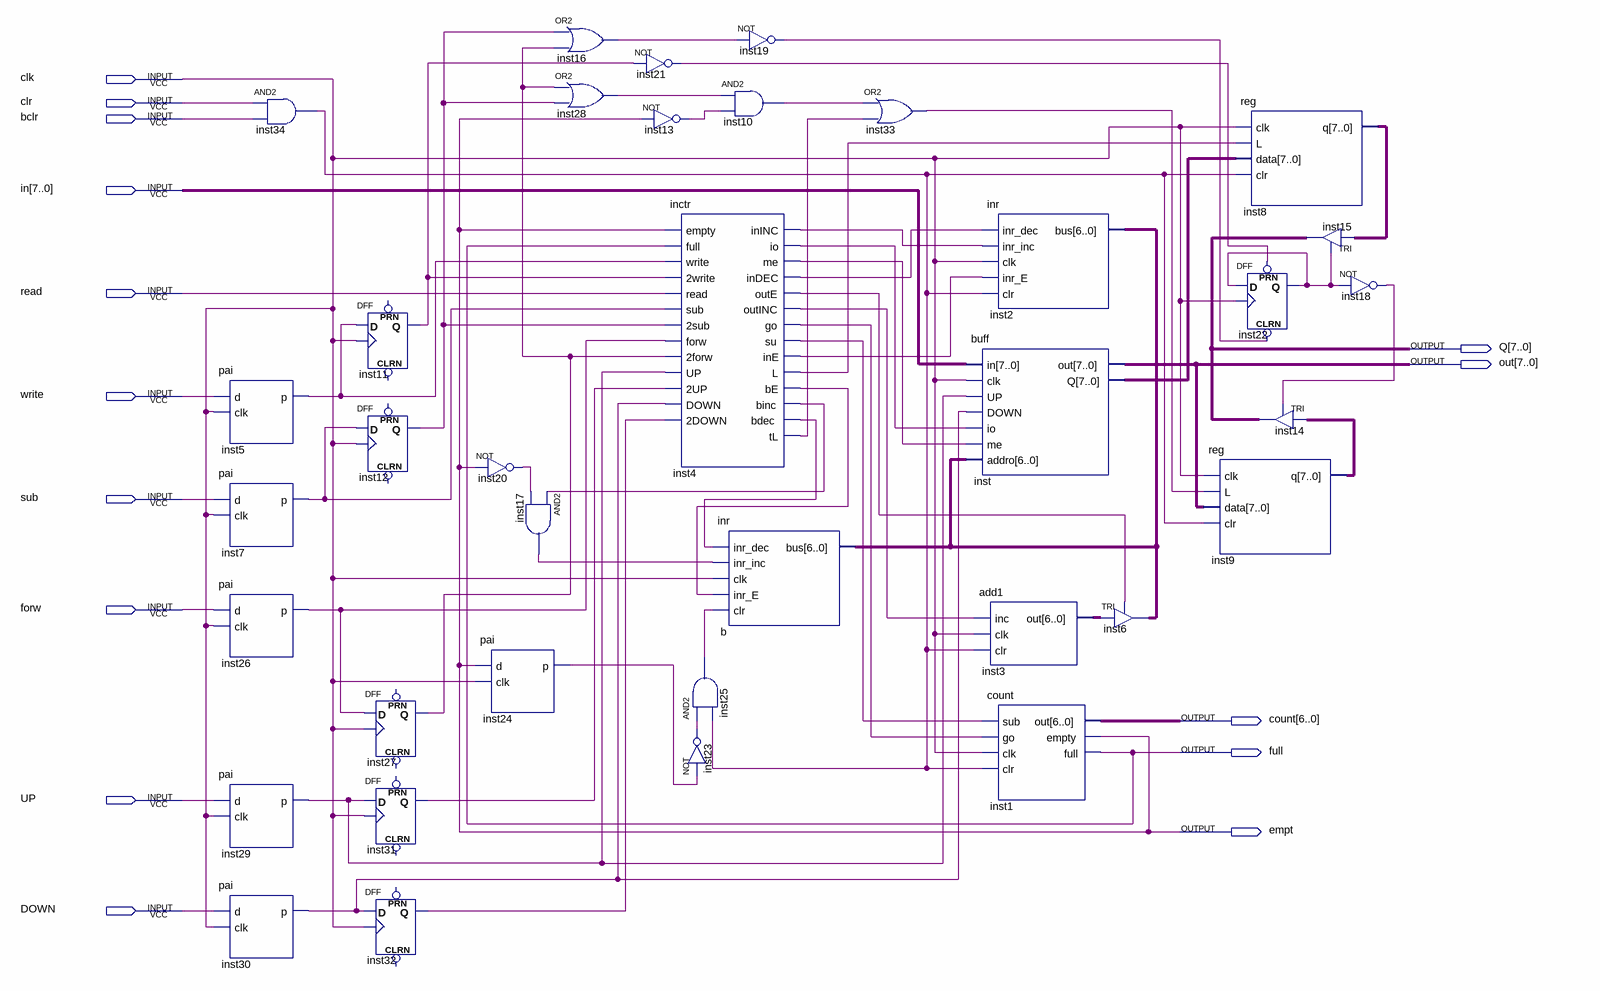
[diagram p0: schematic sheet]
// Quartus schematic buffin.bdf as structural Verilog: 36 symbols, 15 pins
module buffin (
  input  clk,
  input  clr,
  input  bclr,
  input  [7:0] in,
  input  read,
  input  write,
  input  sub,
  input  forw,
  input  UP,
  input  DOWN,
  output [7:0] Q,
  output [7:0] out,
  output [6:0] count,
  output full,
  output empt
);

  wire inst4_bdec, inst4_be, inst4_binc, inst4_go, inst4_indec, inst4_ine, inst4_ininc, inst4_io, inst4_l,
       inst4_me, inst4_oute, inst4_outinc, inst4_su, inst4_tl, inst5_p, inst7_p, inst10_out, inst11_q,
       inst12_q, inst13_out, inst16_out, inst17_out, inst18_out, inst19_out, inst20_out, inst21_out,
       inst22_q, inst23_out, inst24_p, inst25_out, inst26_p, inst27_q, inst28_out, inst29_p, inst30_p,
       inst31_q, inst32_q, inst33_out, inst34_out;
  wire [6:0] b_bus, inst3_out;
  wire [7:0] inst8_q, inst9_q, inst_q;

  and inst34 (inst34_out, clr, bclr);
  pai inst5 (.d(write), .clk(clk), .p(inst5_p));
  pai inst7 (.d(sub), .clk(clk), .p(inst7_p));
  pai inst26 (.d(forw), .clk(clk), .p(inst26_p));
  pai inst29 (.d(UP), .clk(clk), .p(inst29_p));
  pai inst30 (.d(DOWN), .clk(clk), .p(inst30_p));
  DFF inst11 (.CLK(clk), .D(inst5_p), .Q(inst11_q));  // open: CLRN, PRN
  DFF inst12 (.CLK(clk), .D(inst7_p), .Q(inst12_q));  // open: CLRN, PRN
  DFF inst27 (.CLK(clk), .D(inst26_p), .Q(inst27_q));  // open: CLRN, PRN
  DFF inst31 (.CLK(clk), .D(inst29_p), .Q(inst31_q));  // open: CLRN, PRN
  DFF inst32 (.CLK(clk), .D(inst30_p), .Q(inst32_q));  // open: CLRN, PRN
  not inst20 (inst20_out, empt);
  pai inst24 (.d(empt), .clk(clk), .p(inst24_p));
  or inst16 (inst16_out, inst12_q, inst27_q);
  or inst28 (inst28_out, inst27_q, inst12_q);
  and inst17 (inst17_out, inst4_binc, inst20_out);
  not inst21 (inst21_out, inst11_q);
  not inst13 (inst13_out, empt);
  inctr inst4 (
    .empty(empt), .full(full), .write(inst5_p), .\2write (inst11_q), .read(read), .sub(inst7_p),
    .\2sub (inst12_q), .forw(inst26_p), .\2forw (inst27_q), .UP(inst29_p), .\2UP (inst31_q), .DOWN(inst30_p),
    .\2DOWN (inst32_q), .inINC(inst4_ininc), .io(inst4_io), .me(inst4_me), .inDEC(inst4_indec),
    .outE(inst4_oute), .outINC(inst4_outinc), .go(inst4_go), .su(inst4_su), .inE(inst4_ine), .L(inst4_l),
    .bE(inst4_be), .binc(inst4_binc), .bdec(inst4_bdec), .tL(inst4_tl));
  and inst25 (inst25_out, inst23_out, inst34_out);
  not inst23 (inst23_out, inst24_p);
  not inst19 (inst19_out, inst16_out);
  and inst10 (inst10_out, inst28_out, inst13_out);
  inr b (.inr_dec(inst4_bdec), .inr_inc(inst17_out), .clk(clk), .inr_E(inst4_be), .clr(inst25_out), .bus(b_bus));
  or inst33 (inst33_out, inst10_out, inst4_tl);
  inr inst2 (.inr_dec(inst4_indec), .inr_inc(inst4_ininc), .clk(clk), .inr_E(inst4_ine), .clr(inst34_out), .bus(b_bus));
  buff inst (
    .in(in), .clk(clk), .UP(inst29_p), .DOWN(inst30_p), .io(inst4_io), .me(inst4_me), .addro(b_bus),
    .out(out), .Q(inst_q));
  add1 inst3 (.inc(inst4_outinc), .clk(clk), .clr(inst34_out), .out(inst3_out));
  count inst1 (.sub(inst4_su), .go(inst4_go), .clk(clk), .clr(inst34_out), .out(count), .empty(empt), .full(full));
  TRI inst6[6:0] (.IN(inst3_out), .OE(inst4_oute), .OUT(b_bus));
  \reg  inst9 (.clk(clk), .L(inst33_out), .data(out), .clr(inst34_out), .q(inst9_q));
  \reg  inst8 (.clk(clk), .L(inst4_l), .data(inst_q), .clr(inst34_out), .q(inst8_q));
  DFF inst22 (.CLRN(inst19_out), .CLK(clk), .D(inst22_q), .PRN(inst21_out), .Q(inst22_q));
  TRI inst14[7:0] (.IN(inst9_q), .OE(inst18_out), .OUT(Q));
  TRI inst15[7:0] (.IN(inst8_q), .OE(inst22_q), .OUT(Q));
  not inst18 (inst18_out, inst22_q);
endmodule
